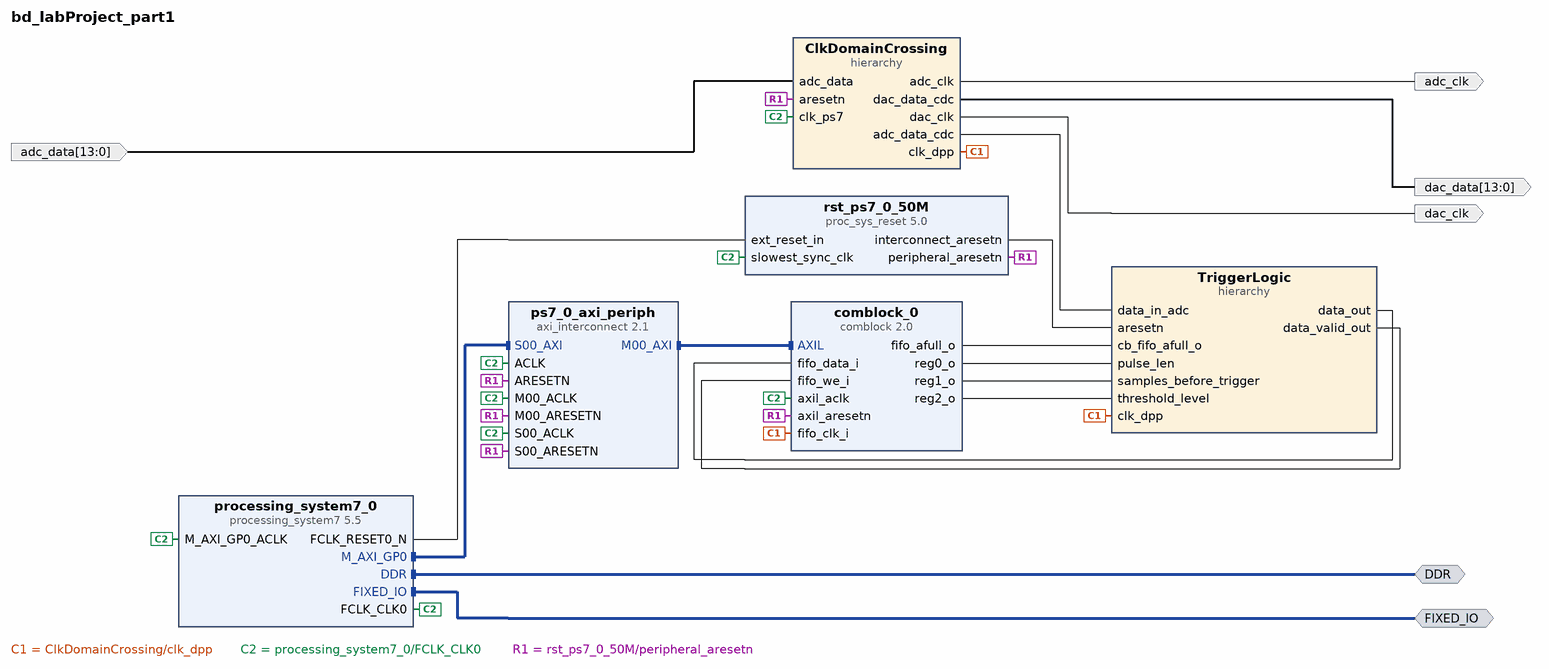
[diagram p0: block diagram of the top level]
# Vivado block design bd_labProject_part1, xc7z020clg484-1, Vivado 2022.2
create_bd_design bd_labProject_part1

create_bd_intf_port -mode Master -vlnv xilinx.com:interface:ddrx_rtl:1.0 DDR
create_bd_intf_port -mode Master -vlnv xilinx.com:display_processing_system7:fixedio_rtl:1.0 FIXED_IO
create_bd_port -dir O -type clk adc_clk
create_bd_port -dir I -from 13 -to 0 adc_data
create_bd_port -dir O -type clk dac_clk
create_bd_port -dir O -from 13 -to 0 -type data dac_data

create_bd_cell -type hier ClkDomainCrossing
create_bd_cell -type hier TriggerLogic
create_bd_cell -type ip -vlnv www.ictp.it:user:comblock:2.0 comblock_0
set_property -dict [list \
  CONFIG.DRAM_IO_ENA false \
  CONFIG.FIFO_IN_DEPTH 2048 \
  CONFIG.FIFO_IN_DWIDTH 14 \
  CONFIG.REGS_IN_ENA false \
  CONFIG.REGS_OUT_DEPTH 3 \
] [get_bd_cells comblock_0]
create_bd_cell -type ip -vlnv xilinx.com:ip:processing_system7:5.5 processing_system7_0
set_property -dict [list \
  CONFIG.PCW_APU_PERIPHERAL_FREQMHZ 666.666667 \
  CONFIG.PCW_ENET0_ENET0_IO {MIO 16 .. 27} \
  CONFIG.PCW_ENET0_GRP_MDIO_ENABLE 1 \
  CONFIG.PCW_ENET0_GRP_MDIO_IO {MIO 52 .. 53} \
  CONFIG.PCW_ENET0_PERIPHERAL_ENABLE 1 \
  CONFIG.PCW_ENET0_RESET_ENABLE 0 \
  CONFIG.PCW_ENET_RESET_ENABLE 1 \
  CONFIG.PCW_ENET_RESET_SELECT {Share reset pin} \
  CONFIG.PCW_FPGA0_PERIPHERAL_FREQMHZ 50 \
  CONFIG.PCW_FPGA1_PERIPHERAL_FREQMHZ 150.000000 \
  CONFIG.PCW_FPGA2_PERIPHERAL_FREQMHZ 50.000000 \
  CONFIG.PCW_GPIO_MIO_GPIO_ENABLE 1 \
  CONFIG.PCW_GPIO_MIO_GPIO_IO MIO \
  CONFIG.PCW_I2C_RESET_ENABLE 1 \
  CONFIG.PCW_PRESET_BANK1_VOLTAGE {LVCMOS 1.8V} \
  CONFIG.PCW_QSPI_PERIPHERAL_ENABLE 0 \
  CONFIG.PCW_SD0_PERIPHERAL_ENABLE 0 \
  CONFIG.PCW_UART1_PERIPHERAL_ENABLE 1 \
  CONFIG.PCW_UART1_UART1_IO {MIO 48 .. 49} \
  CONFIG.PCW_UART_PERIPHERAL_FREQMHZ 50 \
  CONFIG.PCW_UIPARAM_DDR_FREQ_MHZ 533.333313 \
  CONFIG.PCW_UIPARAM_DDR_PARTNO {MT41J128M16 HA-15E} \
  CONFIG.PCW_USB0_PERIPHERAL_ENABLE 0 \
  CONFIG.PCW_USB_RESET_ENABLE 1 \
  CONFIG.preset ZedBoard \
] [get_bd_cells processing_system7_0]
# 219 more settings of processing_system7_0 are not shown: defaults, MIO pin electricals, DDR timing, and values the tool derives
create_bd_cell -type ip -vlnv xilinx.com:ip:axi_interconnect:2.1 ps7_0_axi_periph
set_property -dict {CONFIG.NUM_MI 1} [get_bd_cells ps7_0_axi_periph]
create_bd_cell -type ip -vlnv xilinx.com:ip:proc_sys_reset:5.0 rst_ps7_0_50M

# ---- hierarchy /ClkDomainCrossing ----
current_bd_instance /ClkDomainCrossing
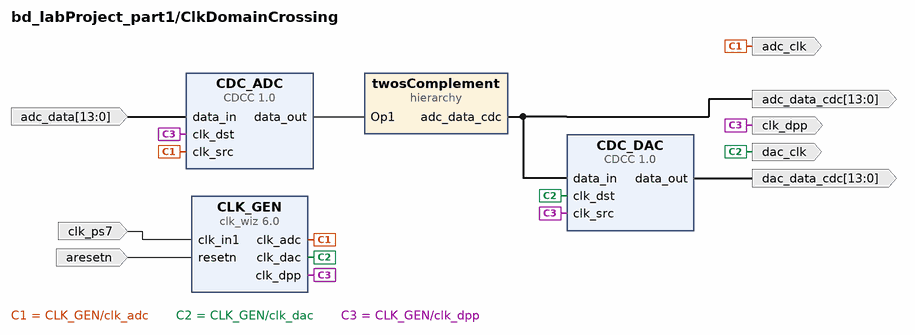
[diagram p1: block diagram inside /ClkDomainCrossing]
create_bd_pin -dir O adc_clk
create_bd_pin -dir I -from 13 -to 0 adc_data
create_bd_pin -dir O -from 13 -to 0 adc_data_cdc
create_bd_pin -dir I -type rst aresetn
create_bd_pin -dir O clk_dpp
create_bd_pin -dir I -type clk clk_ps7
create_bd_pin -dir O dac_clk
create_bd_pin -dir O -from 13 -to 0 dac_data_cdc

create_bd_cell -type ip -vlnv IAEA:user:CDCC:1.0 CDC_ADC
create_bd_cell -type ip -vlnv IAEA:user:CDCC:1.0 CDC_DAC
create_bd_cell -type ip -vlnv xilinx.com:ip:clk_wiz:6.0 CLK_GEN
set_property -dict [list \
  CONFIG.CLKOUT1_JITTER 169.678 \
  CONFIG.CLKOUT1_PHASE_ERROR 158.301 \
  CONFIG.CLKOUT1_REQUESTED_OUT_FREQ 50 \
  CONFIG.CLKOUT1_REQUESTED_PHASE 94 \
  CONFIG.CLKOUT2_JITTER 169.678 \
  CONFIG.CLKOUT2_PHASE_ERROR 158.301 \
  CONFIG.CLKOUT2_REQUESTED_OUT_FREQ 50 \
  CONFIG.CLKOUT2_USED true \
  CONFIG.CLKOUT3_JITTER 169.678 \
  CONFIG.CLKOUT3_PHASE_ERROR 158.301 \
  CONFIG.CLKOUT3_REQUESTED_OUT_FREQ 50 \
  CONFIG.CLKOUT3_REQUESTED_PHASE 134 \
  CONFIG.CLKOUT3_USED true \
  CONFIG.CLK_OUT1_PORT clk_dpp \
  CONFIG.CLK_OUT2_PORT clk_adc \
  CONFIG.CLK_OUT3_PORT clk_dac \
  CONFIG.MMCM_CLKFBOUT_MULT_F 23.000 \
  CONFIG.MMCM_CLKOUT0_DIVIDE_F 23.000 \
  CONFIG.MMCM_CLKOUT0_PHASE 93.913 \
  CONFIG.MMCM_CLKOUT1_DIVIDE 23 \
  CONFIG.MMCM_CLKOUT2_DIVIDE 23 \
  CONFIG.MMCM_CLKOUT2_PHASE 133.043 \
  CONFIG.NUM_OUT_CLKS 3 \
  CONFIG.RESET_PORT resetn \
  CONFIG.RESET_TYPE ACTIVE_LOW \
  CONFIG.USE_FREQ_SYNTH true \
  CONFIG.USE_LOCKED false \
] [get_bd_cells CLK_GEN]
create_bd_cell -type hier twosComplement

# ---- hierarchy /ClkDomainCrossing/twosComplement ----
current_bd_instance /ClkDomainCrossing/twosComplement
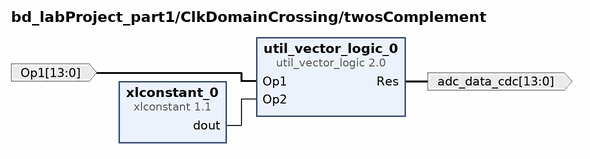
[diagram p2: block diagram inside /ClkDomainCrossing/twosComplement]
create_bd_pin -dir I -from 13 -to 0 Op1
create_bd_pin -dir O -from 13 -to 0 adc_data_cdc

create_bd_cell -type ip -vlnv xilinx.com:ip:util_vector_logic:2.0 util_vector_logic_0
set_property -dict {CONFIG.C_OPERATION xor CONFIG.C_SIZE 14} [get_bd_cells util_vector_logic_0]
create_bd_cell -type ip -vlnv xilinx.com:ip:xlconstant:1.1 xlconstant_0
set_property -dict {CONFIG.CONST_VAL 8192 CONFIG.CONST_WIDTH 14} [get_bd_cells xlconstant_0]

# ---- hierarchy /TriggerLogic ----
current_bd_instance /TriggerLogic
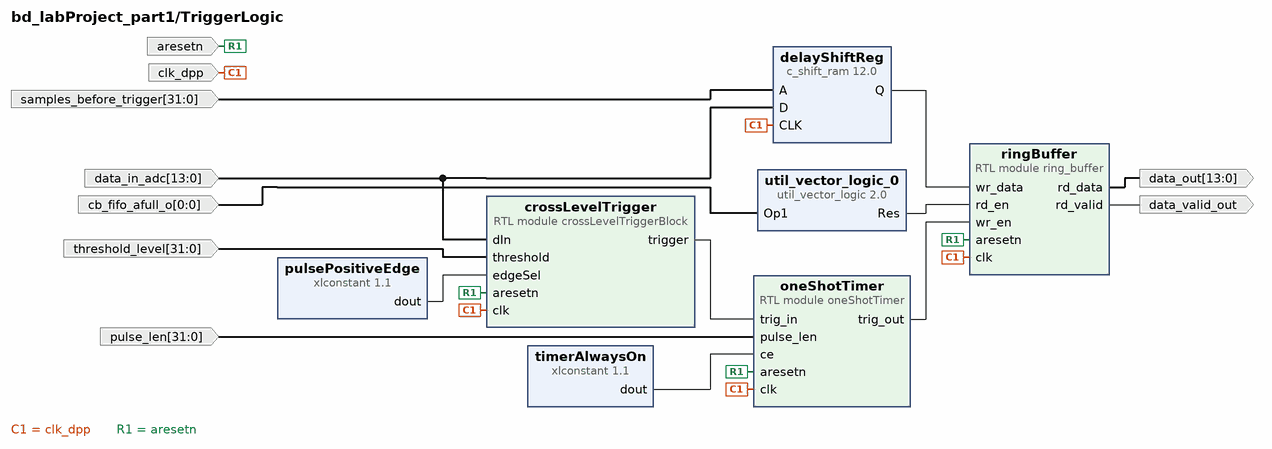
[diagram p3: block diagram inside /TriggerLogic]
create_bd_pin -dir I -type rst aresetn
create_bd_pin -dir I -from 0 -to 0 cb_fifo_afull_o
create_bd_pin -dir I -type clk clk_dpp
create_bd_pin -dir I -from 13 -to 0 -type data data_in_adc
create_bd_pin -dir O -from 13 -to 0 data_out
create_bd_pin -dir O data_valid_out
create_bd_pin -dir I -from 31 -to 0 pulse_len
create_bd_pin -dir I -from 31 -to 0 -type data samples_before_trigger
create_bd_pin -dir I -from 31 -to 0 threshold_level

create_bd_cell -type module -reference crossLevelTriggerBlock crossLevelTrigger
create_bd_cell -type ip -vlnv xilinx.com:ip:c_shift_ram:12.0 delayShiftReg
set_property -dict [list \
  CONFIG.CE false \
  CONFIG.DefaultDataRadix 16 \
  CONFIG.Depth 1024 \
  CONFIG.OptGoal Resources \
  CONFIG.RegLastBit true \
  CONFIG.ShiftRegType Variable_Length_Lossless \
  CONFIG.Width 14 \
] [get_bd_cells delayShiftReg]
create_bd_cell -type module -reference oneShotTimer oneShotTimer
create_bd_cell -type ip -vlnv xilinx.com:ip:xlconstant:1.1 pulsePositiveEdge
set_property -dict {CONFIG.CONST_VAL 0} [get_bd_cells pulsePositiveEdge]
create_bd_cell -type module -reference ring_buffer ringBuffer
set_property -dict {CONFIG.RAM_DEPTH 2048 CONFIG.RAM_WIDTH 14} [get_bd_cells ringBuffer]
create_bd_cell -type ip -vlnv xilinx.com:ip:xlconstant:1.1 timerAlwaysOn
create_bd_cell -type ip -vlnv xilinx.com:ip:util_vector_logic:2.0 util_vector_logic_0
set_property -dict {CONFIG.C_OPERATION not CONFIG.C_SIZE 1} [get_bd_cells util_vector_logic_0]

# ---- connections ----

current_bd_instance /ClkDomainCrossing
connect_bd_net -net CDCC_0_data_out [get_bd_pins twosComplement/adc_data_cdc] [get_bd_pins adc_data_cdc] [get_bd_pins CDC_DAC/data_in]
connect_bd_net -net CDCC_1_data_out [get_bd_pins CDC_DAC/data_out] [get_bd_pins dac_data_cdc]
connect_bd_net [get_bd_pins CDC_ADC/data_out] [get_bd_pins twosComplement/Op1]
connect_bd_net -net clk_wiz_0_clk_adc [get_bd_pins CLK_GEN/clk_adc] [get_bd_pins adc_clk] [get_bd_pins CDC_ADC/clk_src]
connect_bd_net -net clk_wiz_0_clk_dac [get_bd_pins CLK_GEN/clk_dac] [get_bd_pins dac_clk] [get_bd_pins CDC_DAC/clk_dst]
connect_bd_net -net clk_wiz_0_clk_dpp [get_bd_pins CLK_GEN/clk_dpp] [get_bd_pins clk_dpp] [get_bd_pins CDC_ADC/clk_dst] [get_bd_pins CDC_DAC/clk_src]
connect_bd_net -net data_in_0_1 [get_bd_pins adc_data] [get_bd_pins CDC_ADC/data_in]
connect_bd_net -net processing_system7_0_FCLK_CLK0 [get_bd_pins clk_ps7] [get_bd_pins CLK_GEN/clk_in1]
connect_bd_net -net rst_ps7_0_50M_peripheral_aresetn [get_bd_pins aresetn] [get_bd_pins CLK_GEN/resetn]

current_bd_instance /ClkDomainCrossing/twosComplement
connect_bd_net -net CDCC_0_data_out [get_bd_pins util_vector_logic_0/Res] [get_bd_pins adc_data_cdc]
connect_bd_net -net CDC_ADC_data_out [get_bd_pins Op1] [get_bd_pins util_vector_logic_0/Op1]
connect_bd_net [get_bd_pins xlconstant_0/dout] [get_bd_pins util_vector_logic_0/Op2]

current_bd_instance /TriggerLogic
connect_bd_net -net CDCC_0_data_out [get_bd_pins data_in_adc] [get_bd_pins crossLevelTrigger/dIn] [get_bd_pins delayShiftReg/D]
connect_bd_net -net c_shift_ram_0_Q [get_bd_pins delayShiftReg/Q] [get_bd_pins ringBuffer/wr_data]
connect_bd_net -net clk_wiz_0_clk_dpp [get_bd_pins clk_dpp] \
  [get_bd_pins crossLevelTrigger/clk] [get_bd_pins delayShiftReg/CLK] [get_bd_pins oneShotTimer/clk] \
  [get_bd_pins ringBuffer/clk]
connect_bd_net -net comblock_0_fifo_afull_o [get_bd_pins cb_fifo_afull_o] [get_bd_pins util_vector_logic_0/Op1]
connect_bd_net -net comblock_0_reg0_o [get_bd_pins threshold_level] [get_bd_pins crossLevelTrigger/threshold]
connect_bd_net -net comblock_0_reg1_o [get_bd_pins samples_before_trigger] [get_bd_pins delayShiftReg/A]
connect_bd_net -net comblock_0_reg2_o [get_bd_pins pulse_len] [get_bd_pins oneShotTimer/pulse_len]
connect_bd_net -net crossLevelTriggerBlo_0_trigger [get_bd_pins crossLevelTrigger/trigger] [get_bd_pins oneShotTimer/trig_in]
connect_bd_net -net oneShotTimer_0_trig_out [get_bd_pins oneShotTimer/trig_out] [get_bd_pins ringBuffer/wr_en]
connect_bd_net -net ring_buffer_0_rd_data [get_bd_pins ringBuffer/rd_data] [get_bd_pins data_out]
connect_bd_net -net ring_buffer_0_rd_valid [get_bd_pins ringBuffer/rd_valid] [get_bd_pins data_valid_out]
connect_bd_net -net rst_ps7_0_50M_interconnect_aresetn [get_bd_pins aresetn] \
  [get_bd_pins crossLevelTrigger/aresetn] [get_bd_pins oneShotTimer/aresetn] [get_bd_pins ringBuffer/aresetn]
connect_bd_net [get_bd_pins util_vector_logic_0/Res] [get_bd_pins ringBuffer/rd_en]
connect_bd_net -net xlconstant_0_dout [get_bd_pins timerAlwaysOn/dout] [get_bd_pins oneShotTimer/ce]
connect_bd_net -net xlconstant_2_dout [get_bd_pins pulsePositiveEdge/dout] [get_bd_pins crossLevelTrigger/edgeSel]

current_bd_instance /
connect_bd_intf_net [get_bd_intf_ports DDR] [get_bd_intf_pins processing_system7_0/DDR]
connect_bd_intf_net [get_bd_intf_ports FIXED_IO] [get_bd_intf_pins processing_system7_0/FIXED_IO]
connect_bd_intf_net [get_bd_intf_pins processing_system7_0/M_AXI_GP0] [get_bd_intf_pins ps7_0_axi_periph/S00_AXI]
connect_bd_intf_net [get_bd_intf_pins comblock_0/AXIL] [get_bd_intf_pins ps7_0_axi_periph/M00_AXI]
connect_bd_net -net CDCC_0_data_out [get_bd_pins ClkDomainCrossing/adc_data_cdc] [get_bd_pins TriggerLogic/data_in_adc]
connect_bd_net -net CDCC_1_data_out [get_bd_pins ClkDomainCrossing/dac_data_cdc] [get_bd_ports dac_data]
connect_bd_net [get_bd_pins TriggerLogic/data_out] [get_bd_pins comblock_0/fifo_data_i]
connect_bd_net [get_bd_pins TriggerLogic/data_valid_out] [get_bd_pins comblock_0/fifo_we_i]
connect_bd_net -net clk_wiz_0_clk_adc [get_bd_pins ClkDomainCrossing/adc_clk] [get_bd_ports adc_clk]
connect_bd_net -net clk_wiz_0_clk_dac [get_bd_pins ClkDomainCrossing/dac_clk] [get_bd_ports dac_clk]
connect_bd_net -net clk_wiz_0_clk_dpp [get_bd_pins ClkDomainCrossing/clk_dpp] [get_bd_pins TriggerLogic/clk_dpp] [get_bd_pins comblock_0/fifo_clk_i]
connect_bd_net [get_bd_pins comblock_0/fifo_afull_o] [get_bd_pins TriggerLogic/cb_fifo_afull_o]
connect_bd_net -net data_in_0_1 [get_bd_ports adc_data] [get_bd_pins ClkDomainCrossing/adc_data]
connect_bd_net [get_bd_pins processing_system7_0/FCLK_CLK0] \
  [get_bd_pins ClkDomainCrossing/clk_ps7] [get_bd_pins comblock_0/axil_aclk] \
  [get_bd_pins processing_system7_0/M_AXI_GP0_ACLK] [get_bd_pins ps7_0_axi_periph/ACLK] \
  [get_bd_pins ps7_0_axi_periph/M00_ACLK] [get_bd_pins ps7_0_axi_periph/S00_ACLK] \
  [get_bd_pins rst_ps7_0_50M/slowest_sync_clk]
connect_bd_net [get_bd_pins processing_system7_0/FCLK_RESET0_N] [get_bd_pins rst_ps7_0_50M/ext_reset_in]
connect_bd_net -net pulse_len_1 [get_bd_pins comblock_0/reg0_o] [get_bd_pins TriggerLogic/pulse_len]
connect_bd_net [get_bd_pins rst_ps7_0_50M/interconnect_aresetn] [get_bd_pins TriggerLogic/aresetn]
connect_bd_net [get_bd_pins rst_ps7_0_50M/peripheral_aresetn] \
  [get_bd_pins ClkDomainCrossing/aresetn] [get_bd_pins comblock_0/axil_aresetn] [get_bd_pins ps7_0_axi_periph/ARESETN] \
  [get_bd_pins ps7_0_axi_periph/M00_ARESETN] [get_bd_pins ps7_0_axi_periph/S00_ARESETN]
connect_bd_net -net samples_before_trigger_1 [get_bd_pins comblock_0/reg1_o] [get_bd_pins TriggerLogic/samples_before_trigger]
connect_bd_net -net threshold_level_1 [get_bd_pins comblock_0/reg2_o] [get_bd_pins TriggerLogic/threshold_level]

# ---- address map ----
assign_bd_address -offset 0x43C00000 -range 64K -target_address_space [get_bd_addr_spaces processing_system7_0/Data] [get_bd_addr_segs comblock_0/AXIL/AXIL]

validate_bd_design
save_bd_design
